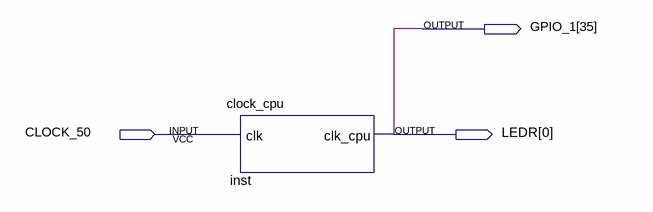
[diagram p0: schematic sheet]
// Quartus schematic project.bdf as structural Verilog: 1 symbols, 3 pins
module project (
  input  CLOCK_50,
  output [35:35] GPIO_1,
  output [0:0] LEDR
);

  clock_cpu inst (.clk(CLOCK_50), .clk_cpu(GPIO_1[35]));

  assign LEDR[0] = GPIO_1[35];
endmodule
